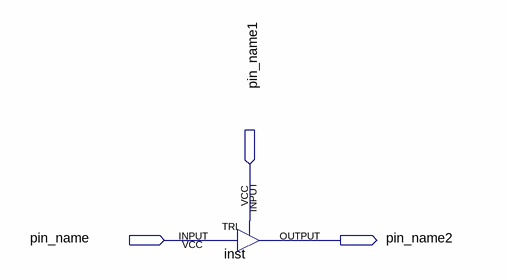
[diagram p0: schematic sheet]
// Quartus schematic santai.bdf as structural Verilog: 1 symbols, 3 pins
module santai (
  input  pin_name1,
  input  pin_name,
  output pin_name2
);

  TRI inst (.IN(pin_name), .OE(pin_name1), .OUT(pin_name2));
endmodule
